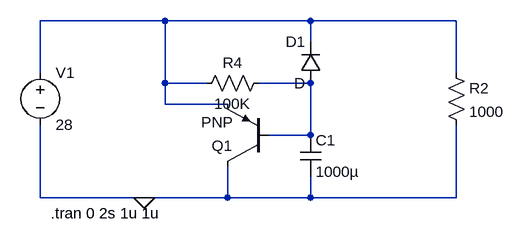
[diagram p0: schematic Slow charge 2.asc]
Slow charge 2.asc, the LTspice schematic file:
Version 4
SHEET 1 880 680
WIRE 176 32 -16 32
WIRE 400 32 176 32
WIRE 624 32 400 32
WIRE 400 64 400 32
WIRE -16 112 -16 32
WIRE 624 112 624 32
WIRE 176 128 176 32
WIRE 240 128 176 128
WIRE 400 128 320 128
WIRE 176 160 176 128
WIRE 272 160 176 160
WIRE 400 208 400 128
WIRE 400 208 336 208
WIRE -16 304 -16 192
WIRE 144 304 -16 304
WIRE 272 304 272 256
WIRE 272 304 144 304
WIRE 400 304 400 272
WIRE 400 304 272 304
WIRE 624 304 624 192
WIRE 624 304 400 304
FLAG 144 304 0
SYMBOL voltage -16 96 R0
WINDOW 123 0 0 Left 2
WINDOW 39 0 0 Left 2
SYMATTR InstName V1
SYMATTR Value 28
SYMBOL pnp 336 256 R180
SYMATTR InstName Q1
SYMBOL res 336 112 R90
WINDOW 0 0 56 VBottom 2
WINDOW 3 32 56 VTop 2
SYMATTR InstName R4
SYMATTR Value 100K
SYMBOL cap 384 208 R0
SYMATTR InstName C1
SYMATTR Value 1000µ
SYMBOL diode 416 128 R180
WINDOW 0 24 64 Left 2
WINDOW 3 24 0 Left 2
SYMATTR InstName D1
SYMBOL res 608 96 R0
SYMATTR InstName R2
SYMATTR Value 1000
TEXT 0 328 Left 2 !.tran 0 2s 1u 1u

The netlist it stands for:
* Slow charge 2.asc
V1 N001 0 28
Q1 0 N002 N001 0 PNP
R4 N002 N001 100K
C1 N002 0 1000µ
D1 N002 N001 D
R2 N001 0 1000
.model D D
.lib standard.dio
.model NPN NPN
.model PNP PNP
.lib standard.bjt
.tran 0 2s 1u 1u
.backanno
.end